# EAGLE design Reflow Château (EAGLE 6.6.0)
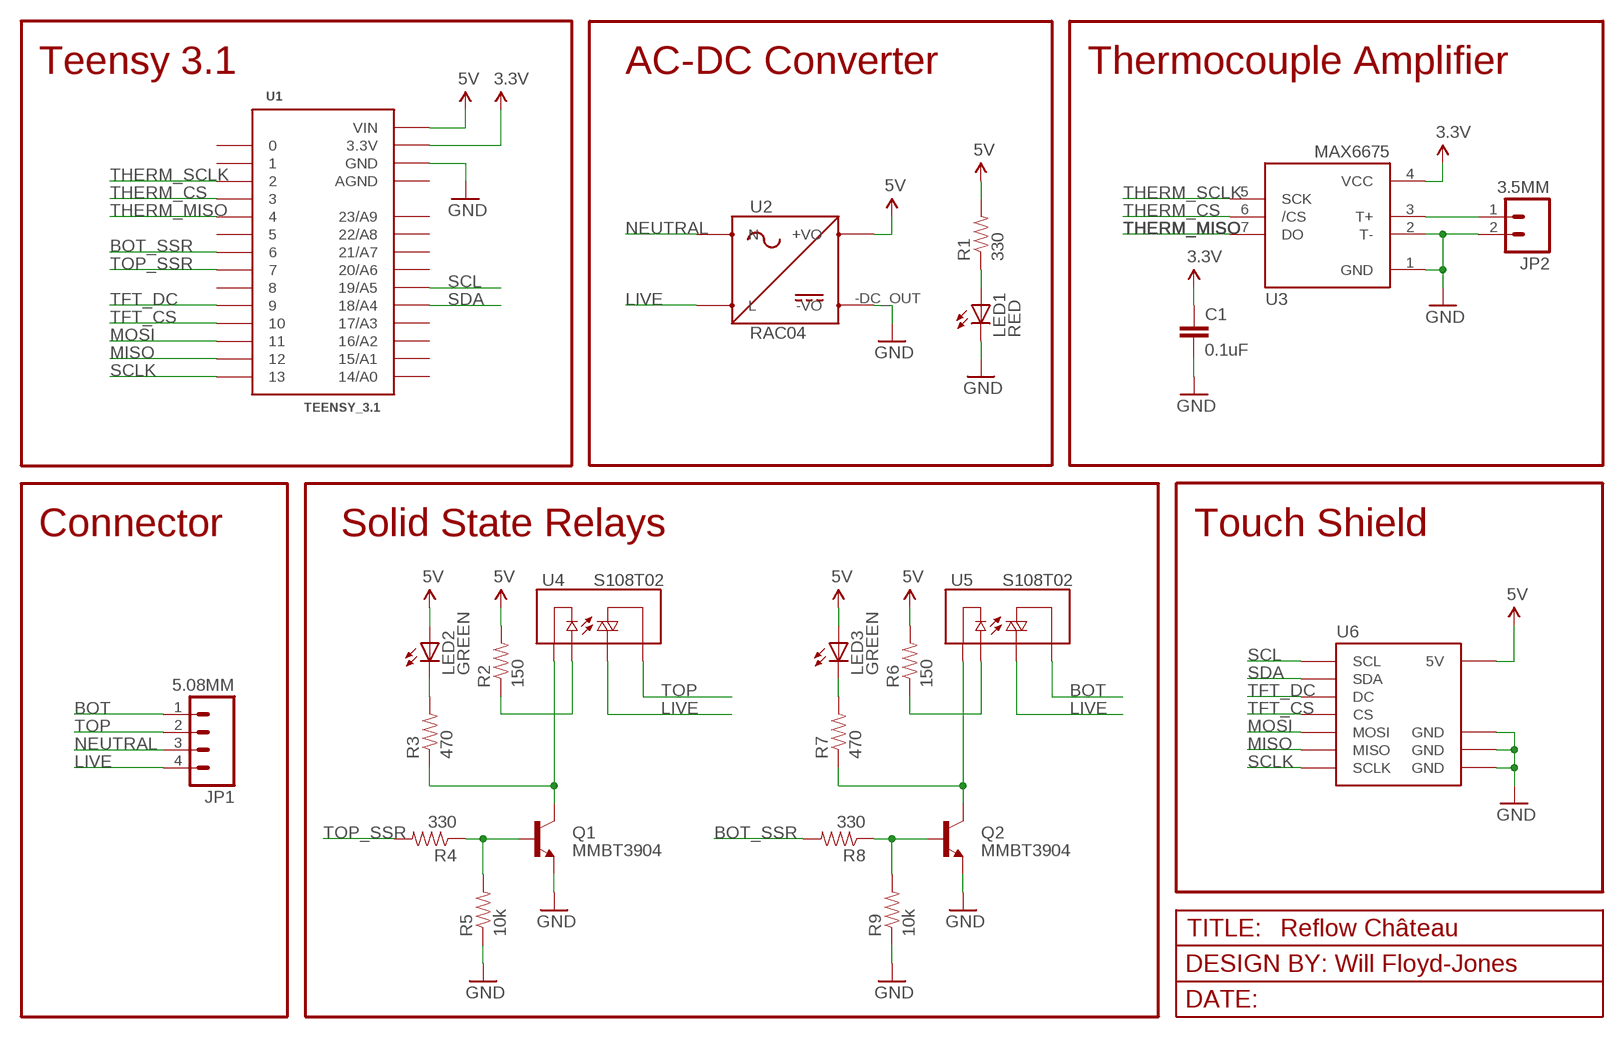
[diagram p0: schematic, sheet 1]

## Parts
C1  0.1uF  CAP0603-CAP  [0603-CAP]
JP1  5.08MM  SCREWTERMINAL-5.08MM-4  [SCREWTERMINAL-5.08MM-4]
JP2  3.5MM  SCREWTERMINAL-3.5MM-2_LOCK  [SCREWTERMINAL-3.5MM-2_LOCK]
LED1  RED  LED-RED1206  [LED-1206]
LED2  GREEN  LED-GREENLILYPAD  [LED-1206]
LED3  GREEN  LED-GREENLILYPAD  [LED-1206]
Q1  MMBT3904  TRANSISTOR_NPNMMBT2222A  [SOT23-3]
Q2  MMBT3904  TRANSISTOR_NPNMMBT2222A  [SOT23-3]
R1  330  RESISTOR0603-RES  [0603-RES]
R2  150  RESISTOR0603  [0603-RES]
R3  470  RESISTOR0603  [0603-RES]
R4  330  RESISTOR0603  [0603-RES]
R5  10k  RESISTOR0603  [0603-RES]
R6  150  RESISTOR0603  [0603-RES]
R7  470  RESISTOR0603  [0603-RES]
R8  330  RESISTOR0603  [0603-RES]
R9  10k  RESISTOR0603  [0603-RES]
U1  TEENSY_3.1  [TEENSY_3.1]
U2  RAC04  [RAC04]
U3  MAX6675  [SO08]
U4  S108T02  RELAY-SOLIDSTATEPTH  [RELAY-S108T02]
U5  S108T02  RELAY-SOLIDSTATEPTH  [RELAY-S108T02]
U6  CAPACITIVE_TOUCH  [CAPACITIVE_TOUCH]
U$9  FRAME  [F-J_LOGO]

## Nets
3.3V: C1.1 U1.3.3V U3.4(VCC)
5V: LED2.A LED3.A R1.2 R2.2 R6.2 U1.VIN U2.+DC_OUT(+VO) U6.5V
BOT: JP1.1 U5.1(T1)
BOT_SSR: R8.2 U1.6
COIL: Q1.3(C) R3.1 U4.4(-)
COIL1: Q2.3(C) R7.1 U5.4(-)
GND [vcc]: C1.2 JP2.2 LED1.C Q1.2(E) Q2.2(E) R5.1 R9.1 U1.GND U2.-DC_OUT(-VO) U3.1(GND) U3.2(T-) U6.GND U6.GND@1(GND) U6.GND@2(GND)
LIVE: JP1.4 U2.LIVE(L) U4.2(T2) U5.2(T2)
MISO: U1.12 U6.D12(MISO)
MOSI: U1.11 U6.D11(MOSI)
N$1: JP2.1 U3.3(T+)
N$2: R2.1 U4.3(+)
N$5: Q2.1(B) R8.1 R9.2
N$6: Q1.1(B) R4.1 R5.2
N$7: LED1.A R1.1
N$8: LED3.C R7.2
N$9: LED2.C R3.2
N$10: R6.1 U5.3(+)
NEUTRAL: JP1.3 U2.NEUTRAL(N)
SCL: U1.19/A5 U6.SCL
SCLK: U1.13 U6.D13(SCLK)
SDA: U1.18/A4 U6.SDA
TFT_CS: U1.10 U6.D10(CS)
TFT_DC: U1.9 U6.D9(DC)
THERM_CS: U1.3 U3.6(/CS)
THERM_MISO: U1.4 U3.7(DO)
THERM_SCLK: U1.2 U3.5(SCK)
TOP: JP1.2 U4.1(T1)
TOP_SSR: R4.2 U1.7
Unconnected: U1.0 U1.1 U1.5 U1.8 U1.14/A0 U1.15/A1 U1.16/A2 U1.17/A3 U1.20/A6 U1.21/A7 U1.22/A8 U1.23/A9

## Notes on the sheet
- Teensy 3.1 | AC-DC Converter | Thermocouple Amplifier
- Connector | Solid State Relays | Touch Shield

## Power pins joined to a net without a drawn wire
AGND: U1.AGND

## Library data of the parts
C1 = SparkFun-Capacitors:CAP: Capacitor Standard 0603 ceramic capacitor, and 0.1" leaded capacitor.
JP1 = F-J:SCREWTERMINAL-5.08MM-4
JP2 = F-J:SCREWTERMINAL-3.5MM-2_LOCK
LED1 = SparkFun-LED:LED-RED: Assorted Red LEDs LilyPad 1206- DIO-09912 1206- DIO-00809 0603- DIO-00819; PROD_ID: DIO-00809
LED2 LED3 = SparkFun-LED:LED-GREEN: Various green LEDs Green LEDs used in SFE Production 0603- DIO-00821 LARGE- DIO-00862 LILYPAD- DIO-09910; PROD_ID: DIO-09910
Q1 Q2 = SparkFun-DiscreteSemi:TRANSISTOR_NPN: Generic NPN BJT MMBT2222A - TRANS-08049 (SOT-23, 1A 40V) MPSA42 - TRANS-09116 (SOT-23, 500mA 300V) MMBT5088LT1G - TRANS-11160 (SOT-23, 50 mA 30V); PROD_ID: TRANS-08049; VALUE: MMBT2222A
R1-R9 = SparkFun-Resistors:RESISTOR: Resistor Basic schematic elements and footprints for 0603, 1206, and PTH resistors.
U1 = F-J:TEENSY_3.1
U2 = F-J:RAC04
U3 = adafruit:MAX6675
U4 U5 = SparkFun:RELAY-SOLIDSTATE
U6 = F-J:CAPACITIVE_TOUCH
U$9 = F-J:FRAME

## Board
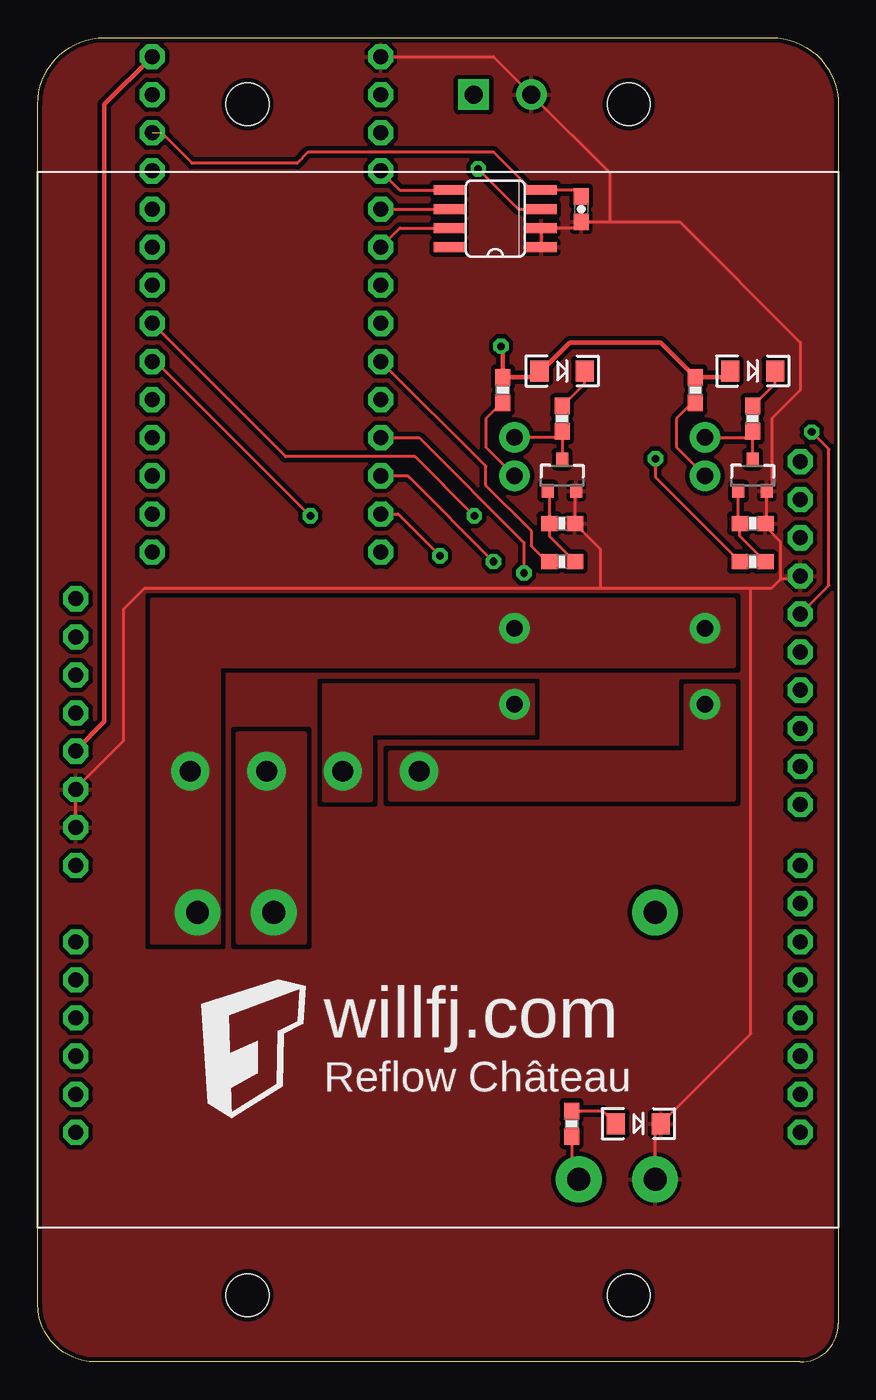
[diagram p1: board, top side]
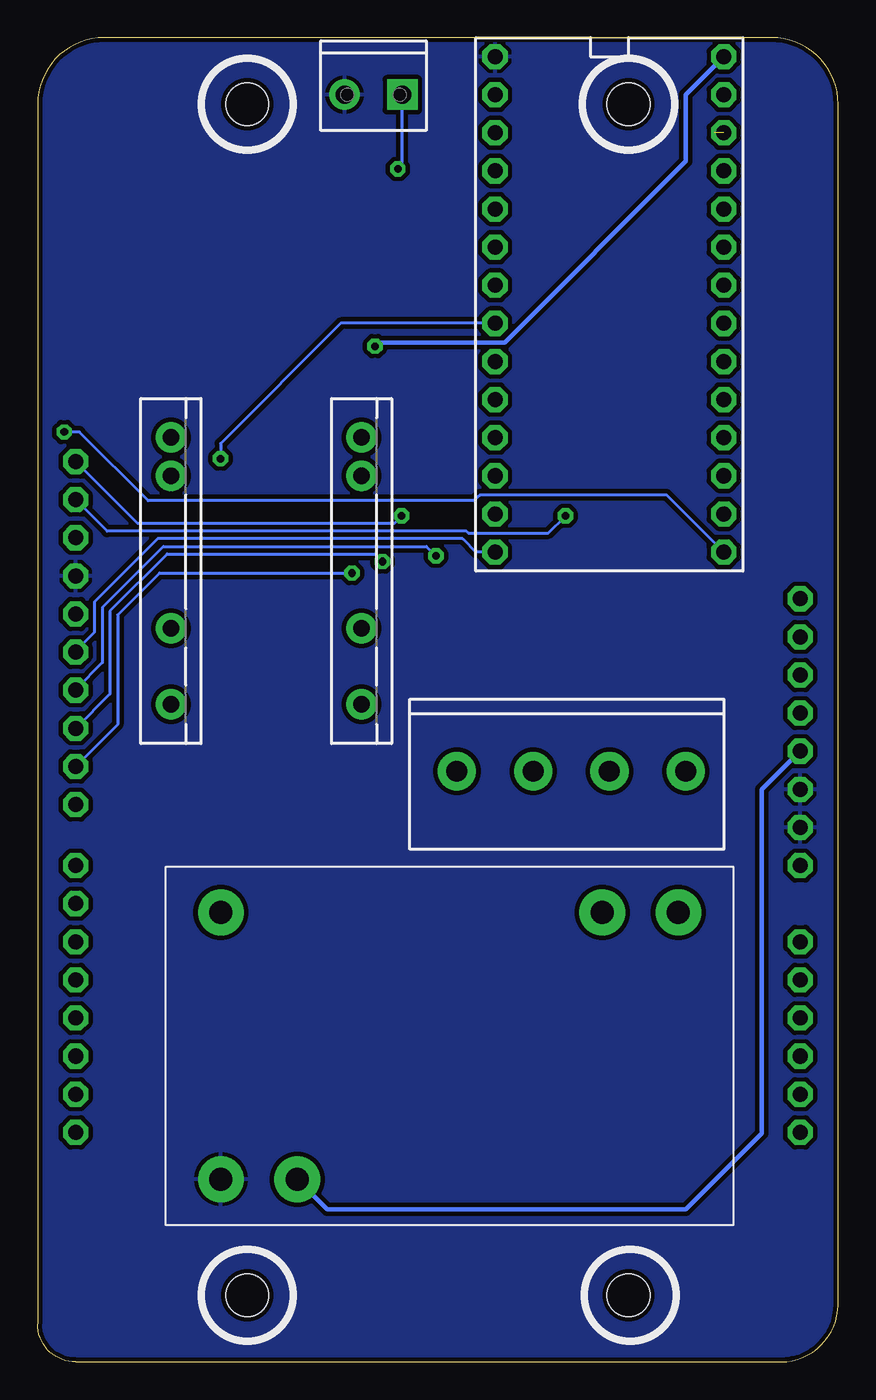
[diagram p2: board, bottom side, seen from below]

Size 53.36 x 88.27 mm. Coordinates in mm from the lower left corner, seen from the top.
Outline: 53.36,83.95 53.36,2.54 arc-90 50.82,0 3.83,0 arc-88 0.02,3.81
Outline: 0.02,3.81 0.02,8.89
Outline: 0.02,8.89 0.02,83.82 arc-90 4.46,88.27 48.91,88.27 arc-90 53.36,83.82
Outline: 0.02,3.81 arc-2 0.02,8.89
Copper layers (1*16): Top 0.035mm / dielectric 1.5mm / Bottom 0.035mm
Design rules "SparkFunDRC *": minimum track width 8mil, minimum drill 20mil, track to track 10mil, track to pad 10mil, pad to pad 10mil, via to via 10mil, smd to smd 10mil, copper to edge 10mil, drill to drill 8mil, minimum pad ring 12mil, minimum via ring 10mil, stop-mask expansion 0mil, vias tented up to drill 40mil, thermal gap 10mil
Holes 2.84 mm at 39.39,4.45 13.99,83.82 39.39,83.82 13.99,4.45

### Footprints (pad centres in the part's own frame; a part is rotated, then mirrored left to right if it is on the bottom)
0603-CAP = smd 1.1 x 1: 1 -0.85,0; 2 0.85,0
SCREWTERMINAL-5.08MM-4 = drill 1.397 pad 2.54: 1 -7.62,0; 2 -2.54,0; 3 2.54,0; 4 7.62,0
SCREWTERMINAL-3.5MM-2_LOCK = drill 1.2 pad 2.032 square: 1 -0.178,0 | drill 1.2 pad 2.032: 2 3.678,0
LED-1206 = smd 1.2 x 1.4: A -1.5,0; C 1.5,0
SOT23-3 = smd 0.8 x 0.9: 1 -0.95,-1; 2 0.95,-1; 3 0,1.1
0603-RES = smd 1.1 x 1: 1 -0.85,0; 2 0.85,0
TEENSY_3.1 = drill 1 pad 1.676 octagon: 0 -7.62,13.97; 1 -7.62,11.43; 2 -7.62,8.89; 3 -7.62,6.35; 3.3V 7.62,11.43; 4 -7.62,3.81; 5 -7.62,1.27; 6 -7.62,-1.27; 7 -7.62,-3.81; 8 -7.62,-6.35; 9 -7.62,-8.89; 10 -7.62,-11.43; 11 -7.62,-13.97; 12 -7.62,-16.51; 13 7.62,-16.51; 14/A0 7.62,-13.97; 15/A1 7.62,-11.43; 16/A2 7.62,-8.89; 17/A3 7.62,-6.35; 18/A4 7.62,-3.81; 19/A5 7.62,-1.27; 20/A6 7.62,1.27; 21/A7 7.62,3.81; 22/A8 7.62,6.35; 23/A9 7.62,8.89; AGND 7.62,13.97; GND -7.62,16.51; VIN 7.62,16.51
RAC04 = drill 1.524 pad 3.048: +DC_OUT 29.06,20.84; -DC_OUT 34.14,20.84; LIVE 3.66,3.06; NC 34.14,3.06; NEUTRAL 8.74,3.06
SO08 = smd 0.66 x 2.032: 1 -1.905,-3.073; 2 -0.635,-3.073; 3 0.635,-3.073; 4 1.905,-3.073; 5 1.905,3.073; 6 0.635,3.073; 7 -0.635,3.073; 8 -1.905,3.073
RELAY-S108T02 = drill 1.1 pad 2.032: 1 -8.88,0; 2 -3.8,0; 3 6.36,0; 4 8.9,0
CAPACITIVE_TOUCH = drill 1 pad 1.676 octagon: 3.3V 36.068,2.54; 5V 38.608,2.54; A0 51.308,2.54; A1 53.848,2.54; A2 56.388,2.54; A3 58.928,2.54; A4 61.468,2.54; A5 64.008,2.54; AREF 24.384,50.8; D0 64.008,50.8; D1 61.468,50.8; D2 58.928,50.8; D3 56.388,50.8; D4 53.848,50.8; D5 51.308,50.8; D6 48.768,50.8; D7 46.228,50.8; D8 42.164,50.8; D9 39.624,50.8; D10 37.084,50.8; D11 34.544,50.8; D12 32.004,50.8; D13 29.464,50.8; GND 26.924,50.8; GND@1 43.688,2.54; GND@2 41.148,2.54; IOREF 30.988,2.54; RESERVED 28.448,2.54; RESET 33.528,2.54; SCL 19.304,50.8; SDA 21.844,50.8; VIN 46.228,2.54

### Placement (x,y rotation side)
C1  36.21,76.83 270 top
JP1  17.8,39.37 0 bottom
JP2  29.23,84.45 180 bottom
LED1  40.02,15.88 0 top
LED2  34.94,66.04 0 top
LED3  47.64,66.04 0 top
Q1  34.94,59.05 0 top
Q2  47.64,59.05 0 top
R1  35.58,15.88 270 top
R2  31,64.77 90 top
R3  34.94,62.87 90 top
R4  34.94,53.34 180 top
R5  34.94,55.88 180 top
R6  43.83,64.77 90 top
R7  47.64,62.87 90 top
R8  47.64,53.34 180 top
R9  47.64,55.88 180 top
U1  15.26,70.48 0 bottom
U2  7,33.02 180 bottom
U3  30.5,76.2 90 top
U4  31.77,52.7 90 bottom
U5  44.47,52.7 90 bottom
U6  0.02,79.31 270 top
U$9  13.99,20.57 0 top

### Tracks (layer width: path | path; a pad name or v marks a point on that pad's centre or on a via)
3.3V  (1 unrouted)
  Top 0.203: C1.1 35.79,78.11 U3.4 32.91,78.11 30.37,80.64 18.05,80.64 17.29,79.88 10.3,79.88 8.27,81.92
5V  (via drill 0.51 pad 1.02)
  Top 0.203: LED2.A 33.54,66.04 33.12,65.62 | R2.2 31,65.66 | 30.71,65.91 R2.2 | R2.2 30.92,65.53 | R1.2 35.58,12.66 U2.+DC_OUT
  Top 0.305: 2.62,40.7 U6.5V 2.56,40.77 4.46,42.67 4.46,83.82 U1.VIN | 30.88,65.75 R2.2 | v30.88,67.69 31,67.56 R2.2 | 33.12,65.62 R2.2 | 33.54,66.04 35.45,67.94 41.51,67.94 R6.2 45.72,65.62 LED3.A
  Bottom 0.305: U2.+DC_OUT 34.04,10.16 10.18,10.16 5.1,15.24 5.1,38.16 U6.5V | v30.88,67.69 30.62,67.94 22.24,67.94 10.18,80.01 10.18,84.45 U1.VIN
BOT
  pour Top (no thermals): 23.51,37.47 23.51,40.64 43.2,40.64 43.2,45.09 46.37,45.09 46.37,37.47
BOT_SSR  (via drill 0.51 pad 1.02)
  Top 0.203: R8.2 46.79,53.55 | 46.75,53.34 R8.2 | v41.16,60.2 41.16,58.97 R8.2
  Bottom 0.203: v41.16,60.2 41.16,61.21 33.16,69.22 U1.6
COIL
  Top 0.203: Q1.3 R3.1 34.53,61.6 U4.4
COIL1
  Top 0.203: U5.4 47.23,61.6 R7.1 Q2.3
GND
  Top 0.203: R5.1 35.66,55.66 | U3.1 U3.2 35.79,75.56 C1.2 | C1.2 36.17,76.37 | 35.76,55.98 R5.1 | 37.48,51.56 7.13,51.56 5.73,50.16 5.73,41.4 2.56,38.23 U6.GND@2 U6.GND@1 | 37.48,51.56 47.51,51.56 | U6.GND 50.56,52.2 49.55,52.2 49.48,52.13 | 36.21,76.11 C1.2 | 47.51,51.56 48.91,51.56 49.48,52.13 | 47.51,51.56 47.51,21.87 LED1.C 41.14,15.49 U2.-DC_OUT | R5.1 37.48,54.19 37.48,51.56 | Q1.2 35.79,57.95 R5.1 | 49.48,52.13 49.48,54.67 48.53,55.63 48.53,55.88 R9.1 48.59,55.98 Q2.2 48.91,58.38 48.91,62.87 50.82,64.77 50.82,67.94 42.78,75.98 38.12,75.98 | C1.2 38.12,75.98 | 38.12,75.98 38.12,79.24 JP2.2 30.36,87 U1.GND
  pour Top (isolate 0.305, rank 2): -5.06,-5.08 58.44,-5.08 58.44,93.34 -5.06,93.34
  pour Bottom (isolate 0.305): -2.52,-2.54 55.9,-2.54 55.9,90.81 -2.52,90.81
LIVE
  pour Top (no thermals): 12.08,27.94 7.64,27.94 7.64,50.8 46.37,50.8 46.37,46.35 12.08,46.35
MISO
  Bottom 0.203: U6.D12 50.82,47.37 49.55,48.64 49.55,50.67 45.35,54.86 25.03,54.86 24.15,53.98 U1.12
MOSI  (via drill 0.51 pad 1.02)
  Top 0.203: v26.81,53.72 24.02,56.52 U1.11
  Bottom 0.203: v26.81,53.72 27.45,54.36 44.97,54.36 49.04,50.29 49.04,46.61 50.82,44.83 U6.D11
N$1  (via drill 0.51 pad 1.02)
  Top 0.203: v29.35,79.5 32.02,76.83 U3.3
  Bottom 0.203: v29.35,79.5 29.05,79.81 JP2.1
N$2
  Top 0.203: 31.22,63.5 31.13,63.5 | 31.13,63.5 30.62,63.5 | U4.3 29.86,60.97 29.86,62.87 30.92,63.92 R2.1 31,63.63 31.13,63.5
N$5
  Top 0.203: 46.79,57.95 Q2.1 46.69,55.98 R9.2 46.79,55.04 R8.1
N$6
  Top 0.203: Q1.1 33.96,57.95 34.09,57.83 R5.2 34.09,55.04 R4.1
N$7
  Top 0.203: R1.1 37.67,16.73 LED1.A
N$8
  Top 0.203: R7.2 49.14,65.22 LED3.C
N$9
  Top 0.203: R3.2 36.44,65.22 LED2.C
N$10
  Top 0.203: R6.1 43.62,63.92 42.56,62.87 42.56,60.97 U5.3
NEUTRAL
  pour Top (no thermals): 13.35,27.94 13.35,41.91 17.8,41.91 17.8,27.94
SCL  (via drill 0.51 pad 1.02)
  Top 0.203: v29.1,56.39 25.16,60.33 16.53,60.33 U1.19/A5
  Bottom 0.203: v29.1,56.39 29.61,55.88 46.69,55.88 U6.SCL
SCLK  (via drill 0.51 pad 1.02)
  Top 0.203: U6.D13 52.72,51.75 52.72,60.83 v51.58,61.98
  Bottom 0.203: v51.58,61.98 50.56,61.98 45.99,57.4 24.27,57.4 24.08,57.59 24.02,57.66 23.89,57.78 11.45,57.78 U1.13
SDA  (via drill 0.51 pad 1.02)
  Top 0.203: v18.18,56.39 7.89,66.67 U1.18/A4
  Bottom 0.203: v18.18,56.39 19.32,55.24 24.65,55.24 24.78,55.37 48.72,55.37 U6.SDA
TFT_CS  (via drill 0.51 pad 1.02)
  Top 0.203: v30.37,53.34 24.72,58.99 24.65,59.05 U1.10
  Bottom 0.203: v30.37,53.34 30.88,53.85 44.72,53.85 48.53,50.04 48.53,44.51 U6.D10
TFT_DC  (via drill 0.51 pad 1.02)
  Top 0.203: v32.4,52.58 32.4,54.61 25.42,61.59 U1.9
  Bottom 0.203: U6.D9 48.02,42.48 48.02,49.78 45.23,52.58 v32.4,52.58
THERM_CS
  Top 0.203: U1.3 U3.6
THERM_MISO
  Top 0.203: U3.7 24.15,75.56 U1.4
THERM_SCLK
  Top 0.203: 27.3,78.23 U3.5 24.15,78.11 U1.2
TOP
  pour Top (no thermals): 19.07,37.47 22.24,37.47 22.24,41.91 33.04,41.91 33.04,45.09 19.07,45.09
TOP_SSR
  Top 0.203: R4.2 33.92,53.34 32.91,54.36 32.91,55.37 29.86,58.42 29.86,59.69 U1.7

### Text on the board
tPlace: willfj.com | Reflow Château